# Altium schematic sheet ETHERNET.SchDoc
size A4; DocumentNumber: 13; SheetNumber: 13; SheetTotal: 27
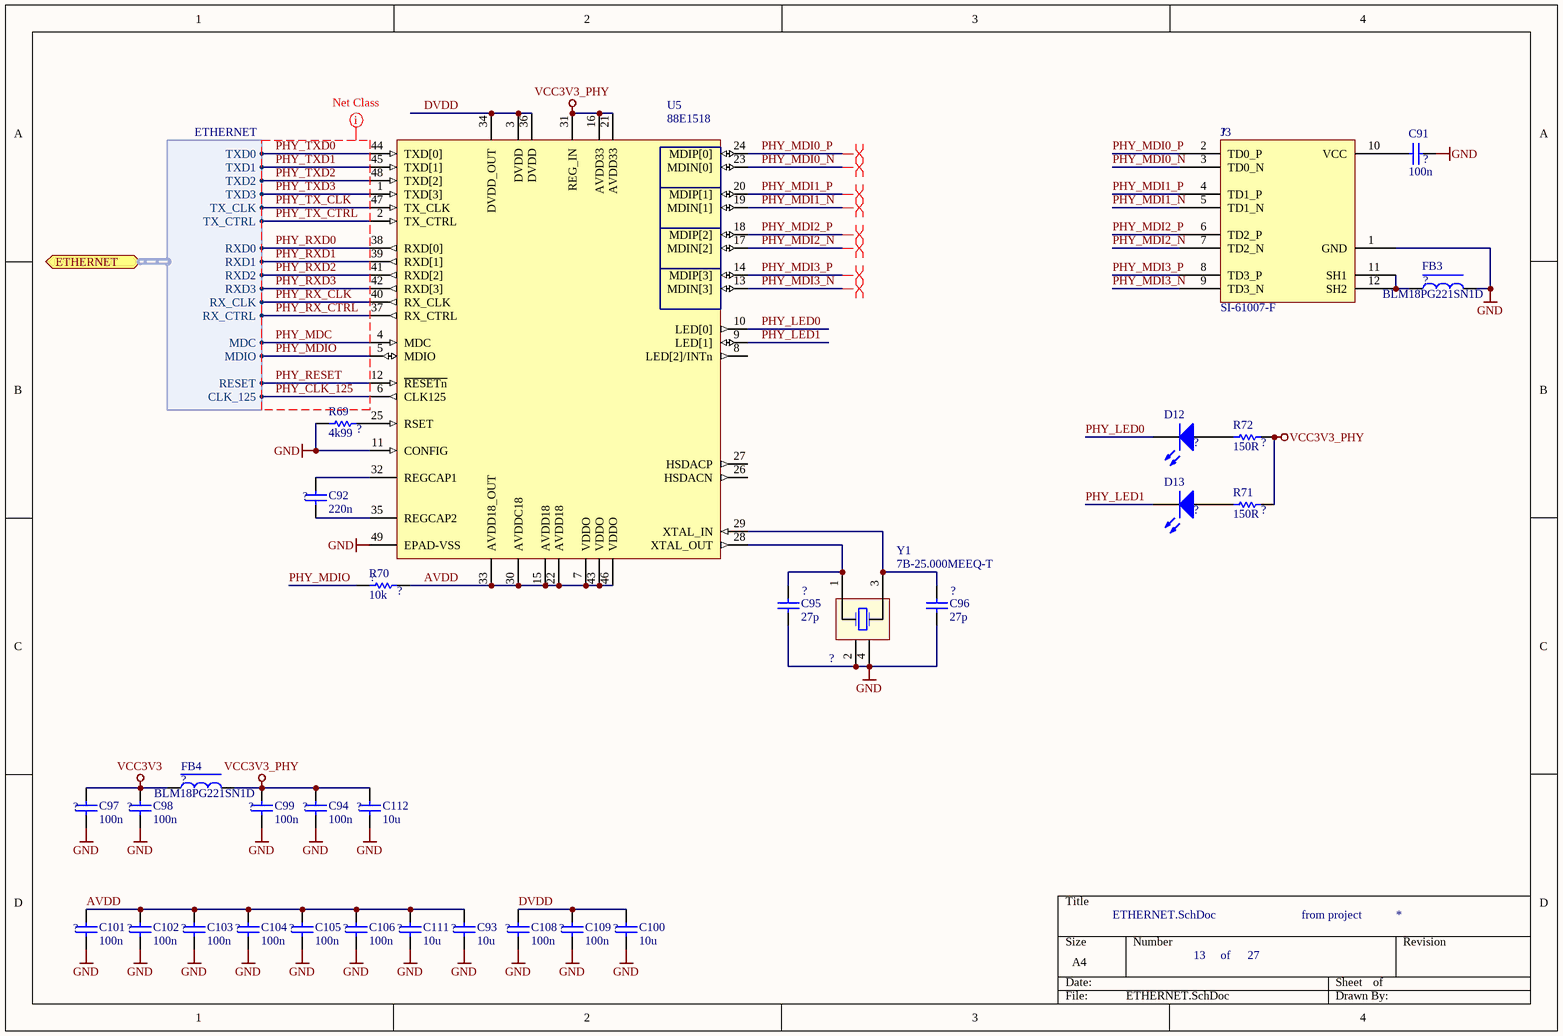
[diagram p0: ETHERNET.SchDoc]

## Parts
C91  100n  [CAPC1005L]
C92  220n  [CAPC1005L]
C93  10u  [CAPC1005L]
C94  100n  [CAPC1005L]
C95  27p  [CAPC1005L]
C96  27p  [CAPC1005L]
C97  100n  [CAPC1005L]
C98  100n  [CAPC1005L]
C99  100n  [CAPC1005L]
C100  10u  [CAPC1005L]
C101  100n  [CAPC1005L]
C102  100n  [CAPC1005L]
C103  100n  [CAPC1005L]
C104  100n  [CAPC1005L]
C105  100n  [CAPC1005L]
C106  100n  [CAPC1005L]
C108  100n  [CAPC1005L]
C109  100n  [CAPC1005L]
C111  10u  [CAPC1005L]
C112  10u  [CAPC1005L]
D12  LED RED  [0603D]  (value not drawn)
D13  LED RED  [0603D]  (value not drawn)
FB3  BLM18PG221SN1D  [INDC1608L]
FB4  BLM18PG221SN1D  [INDC1608L]
J3  SI-61007-F  [HFJ11]
R69  4k99  [RESC1005L]
R70  10k  [RESC1005L]
R71  150R  [RESC1005L]
R72  150R  [RESC1005L]
U5  88E1518  [QFN50P700X700X100_HS-49N]
Y1  7B-25.000MEEQ-T  [CRYSTAL 5 x 3.2 mm (recommended)]

## Ports
ETHERNET (harness ETHERNET)

## Harnesses
ETHERNET: TXD0, TXD1, TXD2, TXD3, TX_CLK, TX_CTRL, RXD0, RXD1, RXD2, RXD3, RX_CLK, RX_CTRL, MDC, MDIO, RESET, CLK_125

## Nets
GND: C91.1 C93.1 C94.1 C95.2 C96.2 C97.1 C98.1 C99.1 C100.1 C101.1 C102.1 C103.1 C104.1 C105.1 C106.1 C108.1 C109.1 C111.1 C112.1 FB3.2 J3.1(GND) R69.2 U5.11(CONFIG) U5.49(EPAD-VSS) Y1.2(GND) Y1.4(GND)
VCC3V3: C97.2 C98.2 FB4.1
VCC3V3_PHY: C94.2 C99.2 C112.2 FB4.2 R71.1 R72.1 U5.16(AVDD33) U5.21(AVDD33) U5.31(REG_IN)
AVDD: C93.2 C101.2 C102.2 C103.2 C104.2 C105.2 C106.2 C111.2 R70.1 U5.7(VDDO) U5.15(AVDD18) U5.22(AVDD18) U5.30(AVDDC18) U5.33(AVDD18_OUT) U5.43(VDDO) U5.46(VDDO)
DVDD: C100.2 C108.2 C109.2 U5.3(DVDD) U5.34(DVDD_OUT) U5.36(DVDD)
PHY_CLK_125: U5.6(CLK125) ; port ETHERNET.CLK_125
PHY_LED0: D12.2(K) U5.10(LED[0])
PHY_LED1: D13.2(K) U5.9(LED[1])
PHY_MDC: U5.4(MDC) ; port ETHERNET.MDC
PHY_MDI0_N: J3.3(TD0_N) U5.23(MDIN[0])
PHY_MDI0_P: J3.2(TD0_P) U5.24(MDIP[0])
PHY_MDI1_N: J3.5(TD1_N) U5.19(MDIN[1])
PHY_MDI1_P: J3.4(TD1_P) U5.20(MDIP[1])
PHY_MDI2_N: J3.7(TD2_N) U5.17(MDIN[2])
PHY_MDI2_P: J3.6(TD2_P) U5.18(MDIP[2])
PHY_MDI3_N: J3.9(TD3_N) U5.13(MDIN[3])
PHY_MDI3_P: J3.8(TD3_P) U5.14(MDIP[3])
PHY_MDIO: R70.2 U5.5(MDIO) ; port ETHERNET.MDIO
PHY_RESET: U5.12(~{RESETn}) ; port ETHERNET.RESET
PHY_RX_CLK: U5.40(RX_CLK) ; port ETHERNET.RX_CLK
PHY_RX_CTRL: U5.37(RX_CTRL) ; port ETHERNET.RX_CTRL
PHY_RXD0: U5.38(RXD[0]) ; port ETHERNET.RXD0
PHY_RXD1: U5.39(RXD[1]) ; port ETHERNET.RXD1
PHY_RXD2: U5.41(RXD[2]) ; port ETHERNET.RXD2
PHY_RXD3: U5.42(RXD[3]) ; port ETHERNET.RXD3
PHY_TX_CLK: U5.47(TX_CLK) ; port ETHERNET.TX_CLK
PHY_TX_CTRL: U5.2(TX_CTRL) ; port ETHERNET.TX_CTRL
PHY_TXD0: U5.44(TXD[0]) ; port ETHERNET.TXD0
PHY_TXD1: U5.45(TXD[1]) ; port ETHERNET.TXD1
PHY_TXD2: U5.48(TXD[2]) ; port ETHERNET.TXD2
PHY_TXD3: U5.1(TXD[3]) ; port ETHERNET.TXD3
NetC91_2: C91.2 J3.10(VCC)
NetC92_1: C92.1 U5.35(REGCAP2)
NetC92_2: C92.2 U5.32(REGCAP1)
NetC95_1: C95.1 U5.28(XTAL_OUT) Y1.1
NetC96_1: C96.1 U5.29(XTAL_IN) Y1.3
NetD12_1: D12.1(A) R72.2
NetD13_1: D13.1(A) R71.2
NetFB3_1: FB3.1 J3.11(SH1) J3.12(SH2)
NetR69_1: R69.1 U5.25(RSET)

Not connected (* = marked no-connect by the designer): U5 8(LED[2]/INTn) 26(HSDACN) 27(HSDACP)

## Layout directives
differential pair: PHY_MDI0_N, PHY_MDI0_P, PHY_MDI1_N, PHY_MDI1_P, PHY_MDI2_N, PHY_MDI2_P, PHY_MDI3_N, PHY_MDI3_P
net class ETH_RGMII: PHY_CLK_125, PHY_MDC, PHY_MDIO, PHY_RESET, PHY_RX_CLK, PHY_RX_CTRL, PHY_RXD0, PHY_RXD1, PHY_RXD2, PHY_RXD3, PHY_TX_CLK, PHY_TX_CTRL, PHY_TXD0, PHY_TXD1, PHY_TXD2, PHY_TXD3

## Notes on the sheet
- from project
- of

## Library data of the parts
C91-C106 C108 C109 C111 C112 = Cap: Capacitor; Manufacturer: Generic Components; Class: Passive; Published: 08/06/2000; Publisher: Altium Hobart Technology Centre; SubClass: Capacitor; SN_CATEGORY: ?
D12 D13 = LED3: Typical RED, GREEN, YELLOW, AMBER GaAs LED; Manufacturer: Generic Components; Class: Optoelectronic; Published: 08/06/2000; Publisher: Altium Hobart Technology Centre; SubClass: LED; SN_CATEGORY: ?
FB3 FB4 = INDUCTOR2: Ferrite Bead; SN_CATEGORY: ?
J3 = RJ45 GB: STEWART CONNECTOR - SI-61007-F - MAGJACK, RJ45, GIGABIT W/O LEDS; SN_CATEGORY: ?
R69-R72 = Res1: Resistor; Manufacturer: Generic Components; Class: Passive; Published: 08/06/2000; Publisher: Altium Hobart Technology Centre; SubClass: Resistor; SN_CATEGORY: ?
U5 = 88E1518: Gigabit Ethernet Transceiver; SN_CATEGORY: ?
Y1 = precision oscilator: 5 x 3.2 mm CRYSTAL  7B SERIES; SN_CATEGORY: ?